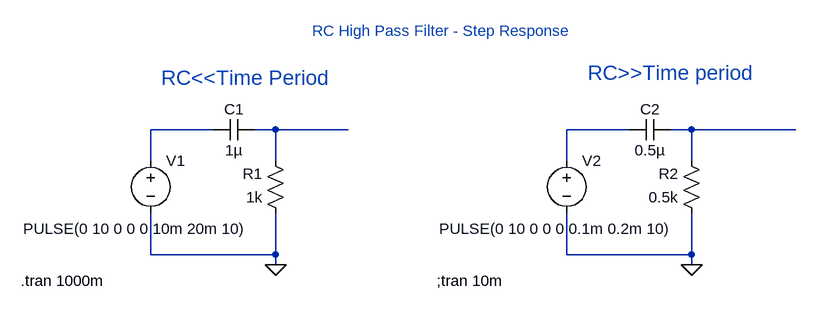
[diagram p0: schematic High Pass RC circuit.asc]
High Pass RC circuit.asc, the LTspice schematic file:
Version 4
SHEET 1 1076 680
WIRE 144 64 48 64
WIRE 240 64 208 64
WIRE 352 64 240 64
WIRE 784 64 688 64
WIRE 880 64 848 64
WIRE 1040 64 880 64
WIRE 48 112 48 64
WIRE 240 112 240 64
WIRE 688 112 688 64
WIRE 880 112 880 64
WIRE 48 256 48 192
WIRE 240 256 240 192
WIRE 240 256 48 256
WIRE 688 256 688 192
WIRE 880 256 880 192
WIRE 880 256 688 256
WIRE 240 272 240 256
WIRE 880 272 880 256
FLAG 240 272 0
FLAG 880 272 0
SYMBOL voltage 48 96 R0
WINDOW 3 -196 120 Left 2
WINDOW 123 0 0 Left 0
WINDOW 39 0 0 Left 0
SYMATTR Value PULSE(0 10 0 0 0 10m 20m 10)
SYMATTR InstName V1
SYMBOL cap 208 48 R90
WINDOW 0 0 32 VBottom 2
WINDOW 3 32 32 VTop 2
SYMATTR InstName C1
SYMATTR Value 1µ
SYMBOL res 256 208 R180
WINDOW 0 36 76 Left 2
WINDOW 3 36 40 Left 2
SYMATTR InstName R1
SYMATTR Value 1k
SYMBOL voltage 688 96 R0
WINDOW 3 -196 120 Left 2
WINDOW 123 0 0 Left 0
WINDOW 39 0 0 Left 0
SYMATTR Value PULSE(0 10 0 0 0 0.1m 0.2m 10)
SYMATTR InstName V2
SYMBOL cap 848 48 R90
WINDOW 0 0 32 VBottom 2
WINDOW 3 32 32 VTop 2
SYMATTR InstName C2
SYMATTR Value 0.5µ
SYMBOL res 896 208 R180
WINDOW 0 36 76 Left 2
WINDOW 3 36 40 Left 2
SYMATTR InstName R2
SYMATTR Value 0.5k
TEXT -152 296 Left 2 !.tran 1000m
TEXT 488 296 Left 2 !;tran 10m
TEXT 720 -24 Left 3 ;RC>>Time period
TEXT 64 -16 Left 3 ;RC<<Time Period
TEXT 296 -88 Left 2 ;RC High Pass Filter - Step Response

The netlist it stands for:
* High Pass RC circuit.asc
V1 N001 0 PULSE(0 10 0 0 0 10m 20m 10)
C1 N002 N001 1µ
R1 0 N002 1k
V2 N003 0 PULSE(0 10 0 0 0 0.1m 0.2m 10)
C2 N004 N003 0.5µ
R2 0 N004 0.5k
.tran 1000m
;tran 10m
* RC>>Time period
* RC<<Time Period
* RC High Pass Filter - Step Response
.backanno
.end